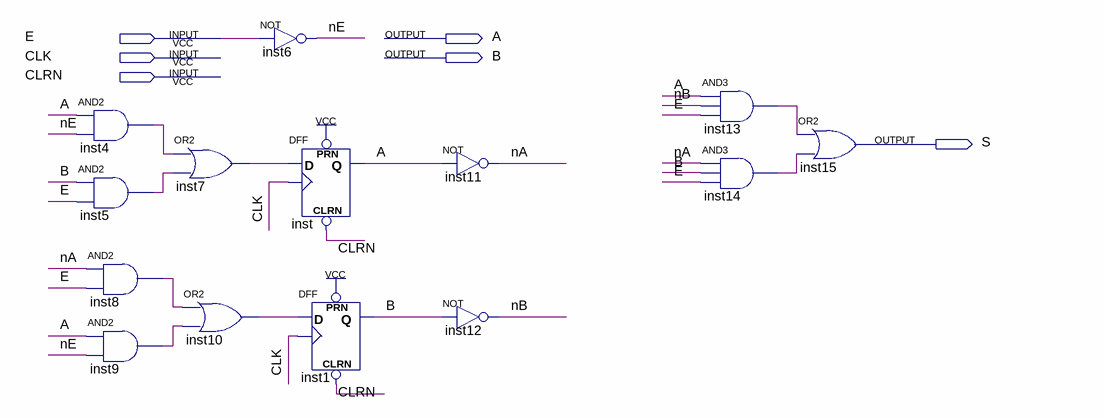
[diagram p0: schematic sheet]
// Quartus schematic FSM.bdf as structural Verilog: 14 symbols, 6 pins
module FSM (
  input  E,
  input  CLK,
  input  CLRN,
  output A,
  output B,
  output S
);

  wire inst4_out, inst5_out, inst7_out, inst8_out, inst9_out, inst10_out, inst13_out, inst14_out, nA, nB, nE;

  and inst4 (inst4_out, A, nE);
  and inst5 (inst5_out, B, E);
  and inst8 (inst8_out, nA, E);
  and inst9 (inst9_out, A, nE);
  or inst7 (inst7_out, inst4_out, inst5_out);
  or inst10 (inst10_out, inst8_out, inst9_out);
  not inst6 (nE, E);
  DFF inst (.CLRN(CLRN), .CLK(CLK), .D(inst7_out), .PRN(1'b1), .Q(A));
  DFF inst1 (.CLRN(CLRN), .CLK(CLK), .D(inst10_out), .PRN(1'b1), .Q(B));
  not inst11 (nA, A);
  not inst12 (nB, B);
  and inst13 (inst13_out, A, nB, E);
  and inst14 (inst14_out, nA, B, E);
  or inst15 (S, inst13_out, inst14_out);
endmodule
